# Altium project FRONT.PrjPcb (part 2 of 2)

## Sheet FRONT_MCU_v1.SchDoc: SDR200
size 420 x 297 mm; DocumentNumber: XXXX.468179.001 Э3; SheetNumber: 6; SheetTotal: 7; Title2str: Передняя панель; DocumentType: Схема электрическая принципиальная; Scale: 1:1
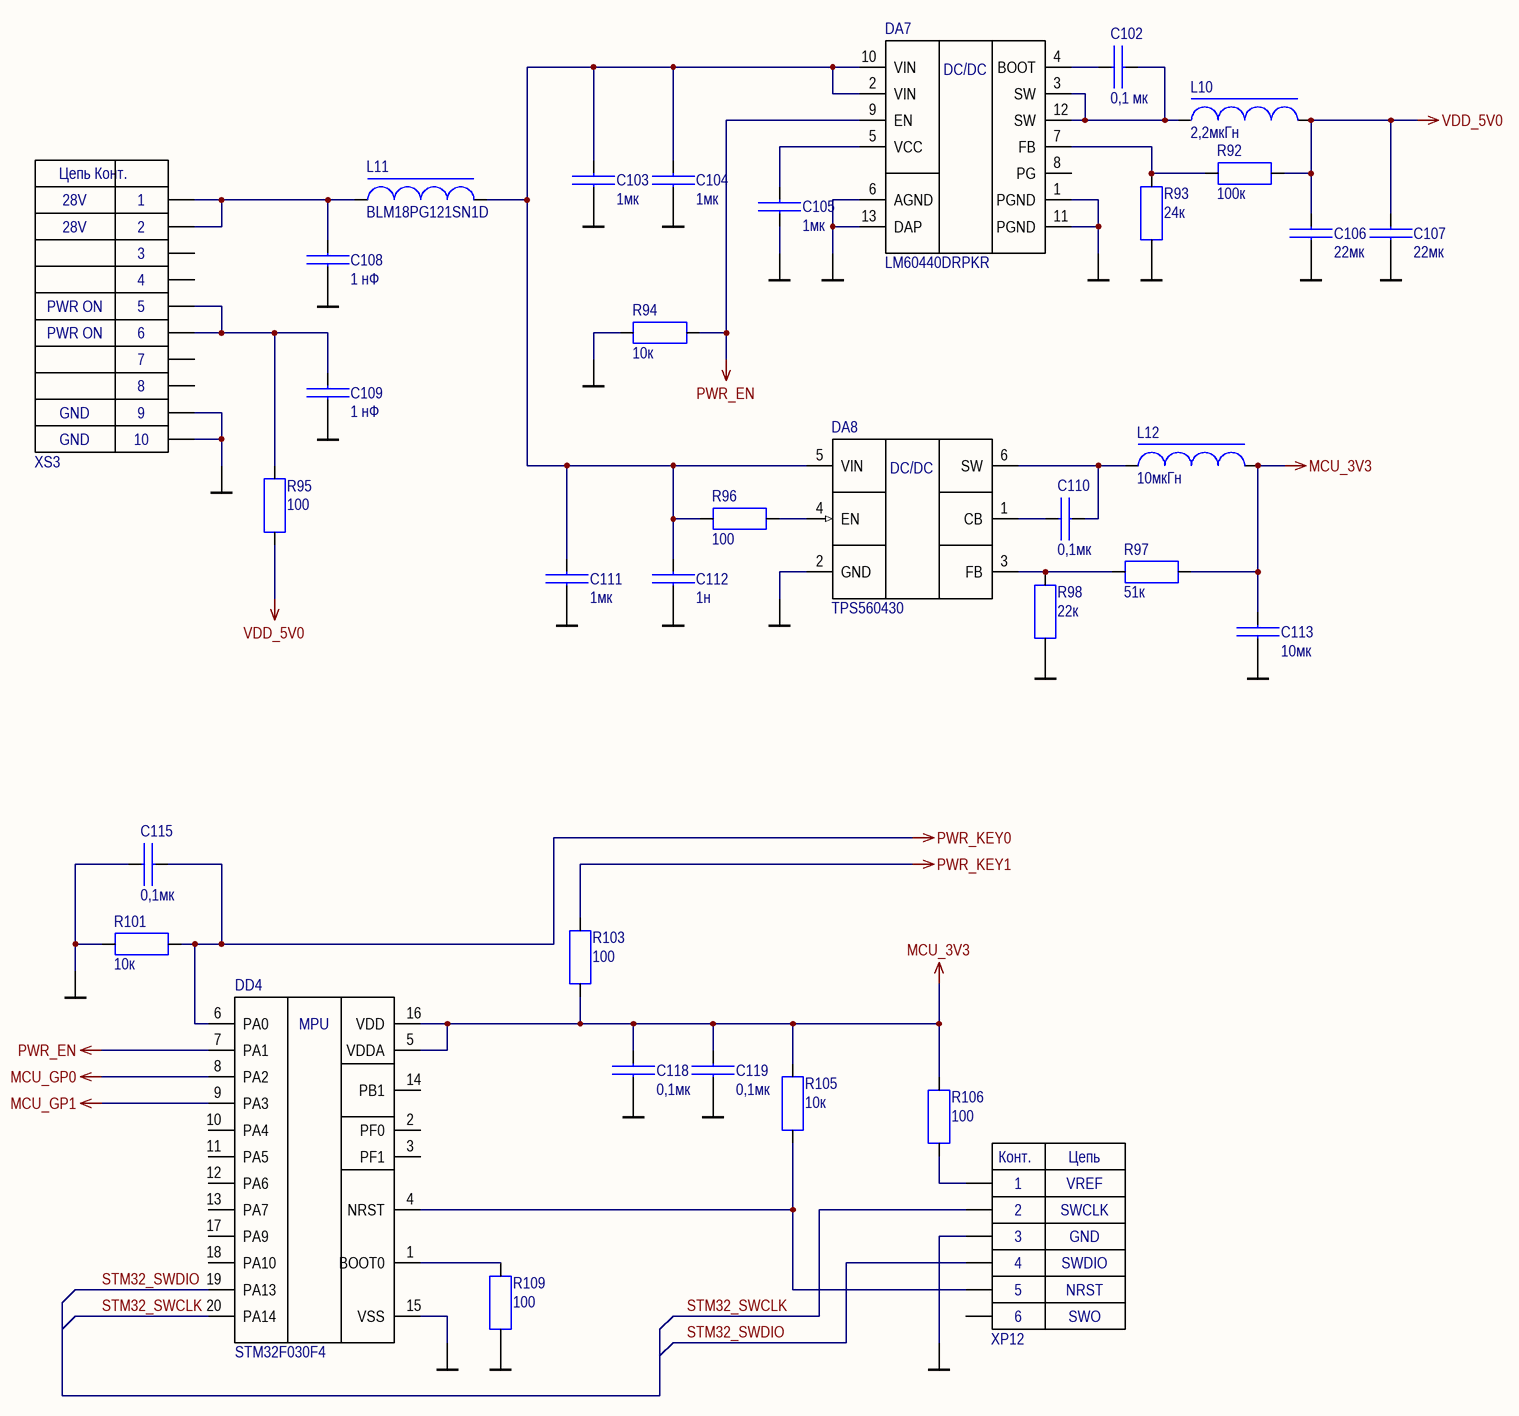
[diagram p5: FRONT_MCU_v1.SchDoc]

### Parts
C102  Nominal: 0,1 мк  [CAPC1005X05L]  (hidden comment: CC0402KRX5R6BB104)
C103  Nominal: 1мк  [CAPC2012X09L]  (hidden comment: CC0805KKX7R9BB105)
C104  Nominal: 1мк  [CAPC2012X09L]  (hidden comment: CC0805KKX7R9BB105)
C105  Nominal: 1мк  [CAPC1005X05L]  (hidden comment: CC0402KRX5R5BB105)
C106  Nominal: 22мк  [CAPC2012X09L]  (hidden comment: CC0805MKX5R5BB226)
C107  Nominal: 22мк  [CAPC2012X09L]  (hidden comment: CC0805MKX5R5BB226)
C108  Nominal: 1 нФ  [CAPC1005X05L]
C109  Nominal: 1 нФ  [CAPC1005X05L]
C110  Nominal: 0,1мк  [CAPC1608X08L]  (hidden comment: CC0603KRX7R9BB103)
C111  Nominal: 1мк  [CAPC2012X09L]  (hidden comment: CC0805KKX7R9BB105)
C112  Nominal: 1н  [CAPC1005X05L]  (hidden comment: C0402C102J5GACTU)
C113  Nominal: 10мк  [CAPC2012X09L]  (hidden comment: CC0805KKX5R8BB106)
C115  Nominal: 0,1мк  [CAPC1005X05L]  (hidden comment: CC0402KRX5R6BB104)
C118  Nominal: 0,1мк  [CAPC1005X05L]  (hidden comment: CC0402KRX5R6BB104)
C119  Nominal: 0,1мк  [CAPC1005X05L]  (hidden comment: CC0402KRX5R6BB104)
DA7  LM60440DRPKR  [WQFN-13]
DA8  TPS560430  [SOT95P280X145-6L]
DD4  STM32F030F4  [TSOP65P640X120-20L]
L10  Nominal: 2,2мкГн  [INDCXGL4020]  (hidden comment: XGL4020-222ME)
L11  BLM18PG121SN1D  [INDC1608X05L]
L12  Nominal: 10мкГн  [INDC1812PS]  (hidden comment: 1812PS-103KR)
R92  Nominal: 100к  [RESC1005X04L]  (hidden comment: RC0402JR-07100KL)
R93  Nominal: 24к  [RESC1005X04L]  (hidden comment: RC0402JR-0724KL)
R94  Nominal: 10к  [RESC1005X04L]  (hidden comment: RC0402JR-0710KL)
R95  Nominal: 100  [RESC1005X04L]  (hidden comment: RC0402JR-07100RL)
R96  Nominal: 100  [RESC1005X04L]  (hidden comment: RC0402JR-07100RL)
R97  Nominal: 51к  [RESC1005X04L]  (hidden comment: RC0402JR-0751KL)
R98  Nominal: 22к  [RESC1005X04L]  (hidden comment: RC0402JR-0722KL)
R101  Nominal: 10к  [RESC1005X04L]  (hidden comment: RC0402JR-0710KL)
R103  Nominal: 100  [RESC1005X04L]  (hidden comment: RC0402JR-07100RL)
R105  Nominal: 10к  [RESC1005X04L]  (hidden comment: RC0402JR-0710KL)
R106  Nominal: 100  [RESC1005X04L]  (hidden comment: RC0402JR-07100RL)
R109  Nominal: 100  [RESC1005X04L]  (hidden comment: RC0402JR-07100RL)
XP12  PLS-6  [HDR1X6]  (value not drawn)
XS3  FH12-10S-0.5SVA  [FH12-10S-0.5SH]  (value not drawn)

### Nets
GND: C103.1 C104.1 C105.1 C106.1 C107.1 C108.1 C109.1 C111.2 C112.2 C113.1 C115.1 C118.2 C119.2 DA7.1(PGND) DA7.6(AGND) DA7.11(PGND) DA7.13(DAP) DA8.2(GND) DD4.15(VSS) R93.2 R94.2 R98.1 R101.2 R109.1 XP12.3 XS3.9 XS3.10
MCU_3V3: C113.2 C118.1 C119.1 DD4.5(VDDA) DD4.16(VDD) L12.1 R97.1 R103.1 R105.2 R106.2
MCU_GP0: DD4.8(PA2)
MCU_GP1: DD4.9(PA3)
PWR_EN: DA7.9(EN) DD4.7(PA1) R94.1
PWR_KEY0: C115.2 DD4.6(PA0) R101.1
PWR_KEY1: R103.2
VDD_5V0: C106.2 C107.2 L10.1 R92.1 R95.1  [project net BL_PWR]
STM32_SWCLK: DD4.20(PA14) XP12.2
STM32_SWDIO: DD4.19(PA13) XP12.4
NetC102_1: C102.1 DA7.4(BOOT)
NetC102_2: C102.2 DA7.3(SW) DA7.12(SW) L10.2
NetC103_2: C103.2 C104.2 C111.1 C112.1 DA7.2(VIN) DA7.10(VIN) DA8.5(VIN) L11.1 R96.1
NetC105_2: C105.2 DA7.5(VCC)
NetC108_2: C108.2 L11.2 XS3.1 XS3.2
NetC109_2: C109.2 R95.2 XS3.5 XS3.6
NetC110_1: C110.1 DA8.1(CB)
NetC110_2: C110.2 DA8.6(SW) L12.2
NetDA7_7: DA7.7(FB) R92.2 R93.1
NetDA8_3: DA8.3(FB) R97.2 R98.2
NetDA8_4: DA8.4(EN) R96.2
NetDD4_1: DD4.1(BOOT0) R109.2
NetDD4_4: DD4.4(NRST) R105.1 XP12.5
NetR106_1: R106.1 XP12.1

Not connected (* = marked no-connect by the designer): DA7 8(PG); DD4 2(PF0) 3(PF1) 10(PA4) 11(PA5) 12(PA6) 13(PA7) 14(PB1) 17(PA9) 18(PA10); XP12 6; XS3 3 4 7 8

### Notes on the sheet
- 28V
- PWR ON
- GND
- Подп. и дата
- Инв. № дубл.
- Взам. инв. №
- Инв. № подл.
- Изм.
- Лист
- № докум.
- Подп.
- Дата
- 2.106-A3
- Копировал
- Формат А3
- (in symbol FH12-10S-0.5SVA) Цепь; Конт.
- (in symbol LM60440DRPKR) DC/DC
- (in symbol STM32 S-LINK PLS-6) Конт.; Цепь; VREF; SWCLK; GND; SWDIO; NRST; SWO
- (in symbol STM32F030F4) MPU
- (in symbol TPS560430) DC/DC

### Library data of the parts
C102 C115 C118 C119 = CC0402KRX5R6BB104: as C1 on sheet FRONT_PWR; ManufacturerPartNumber: CC0402KRX5R6BB104; Rem: *
C103 C104 C111 = CC0805KKX7R9BB105: ЧИП конденсатор; Manufacturer: Yageo; ID: 0805 1 мкФ 50В X7R; Tolerance: 0,1; Type: X7R; Value: 0805 1 мкФ 50В X7R; RuNominal: 1 мкФ; Voltage: 50В; ManufacturerPartNumber: CC0805KKX7R9BB105; Rem: *
C105 = CC0402KRX5R5BB105: ЧИП конденсатор; Manufacturer: Yageo; ID: 0402 1 мкФ 6,3В X5R; Tolerance: 10%; Type: X5R; Value: 0402 1 мкФ 6,3В X5R; RuNominal: 1 мкФ; Voltage: 6,3В; ManufacturerPartNumber: CC0402KRX5R5BB105; Rem: *
C106 C107 = CC0805MKX5R5BB226: ЧИП конденсатор; Manufacturer: Yageo; ID: 0805 22 мкФ 6,3В X5R; Tolerance: 0,2; Type: X5R; Value: 0805 22 мкФ 6,3В X5R; RuNominal: 22 мкФ; Voltage: 6,3В; ManufacturerPartNumber: CC0805MKX5R5BB226; Rem: *
C108 C109 = C0402C102J5GACTU: ЧИП конденсатор; Manufacturer: Yageo; ID: 0402 1 нФ 50В C0G; Tolerance: 5%; Type: C0G; Value: 0402 1 нФ 50В C0G; Voltage: 50В; ManufacturerPartNumber: C0402C102J5GACTU; Rem: *; RuNominal: 1 нФ
C110 = CC0603KRX7R9BB103: ЧИП конденсатор; Manufacturer: Yageo; ID: 0603 0,1 мкФ 50В X7R; Tolerance: 10%; Type: X7R; Value: 0603 0,1 мкФ 50В X7R; RuNominal: 0,1 мкФ; Voltage: 50В; ManufacturerPartNumber: CC0603KRX7R9BB103; Rem: *
C112 = C0402C102J5GACTU: ЧИП конденсатор; Manufacturer: Yageo; ID: 0402 1 нФ 50В C0G; Tolerance: 5%; Type: C0G; Value: 0402 1 нФ 50В C0G; RuNominal: 1 нФ; Voltage: 50В; ManufacturerPartNumber: C0402C102J5GACTU; Rem: *
C113 = CC0805KKX5R8BB106: ЧИП конденсатор; Manufacturer: Yageo; ID: 0805 10 мкФ 25В X7R; Tolerance: 0,1; Type: X7R; Value: 0805 10 мкФ 25В X7R; RuNominal: 10 мкФ; Voltage: 25В; ManufacturerPartNumber: CC0805KKX5R8BB106; Rem: *
DA7 = LM60440DRPKR: 3.8-V to 36-V, 4-A Ultra-Small Synchronous Step-Down Converter; Manufacturer: TI; Value: LM60440DRPKR; ComponentLink1Description: datasheet; ComponentLink1URL: https://www.ti.com/lit/ds/symlink/lm60440.pdf?HQS=dis-dk-null-digikeymode-dsf-pf-null-wwe&ts=1663282176250&ref_url=https%253A%252F%252Fwww.digikey.si%252F; ManufacturerPartNumber: LM60440DRPKR; Rem: *
DA8 = TPS560430: SIMPLE SWITCHER® 4-V to 36-V, 600-mA Synchronous Step-Down Converter; Manufacturer: TI; Value: TPS560430; ComponentLink1Description: datasheet; ComponentLink1URL: https://www.ti.com/lit/ds/symlink/tps560430.pdf?ts=1769393151340; ManufacturerPartNumber: TPS560430; Rem: *
DD4 = STM32F030F4: Value-line Arm®-based 32-bit MCU with16 KB Flash, timers, ADC, communication interfaces, 2.4-3.6 V operation; Manufacturer: STM; ComponentLink1Description: datasheet; ComponentLink1URL: http://www.analog.com/media/en/technical-documentation/data-sheets/ADCLK944.pdf; ManufacturerPartNumber: STM32F030F4; Rem: *; Value: STM32F030F4
L10 = XGL4020-222ME: Shielded Power Inductors; Manufacturer: Coilcraft; ID: XGL4020 2,2мкГн; Value: XGL4020 2,2мкГн; Current: 2,7А; DC Res: 19,5mOhms; ManufacturerPartNumber: XGL4020-222ME
L11 = BLM18PG121SN1D: as L5 on sheet FRONT_PWR; Nominal: BLM18PG121SN1D; ID: BLM18PG121SN1D; ManufacturerPartNumber: BLM18PG121SN1D; Value: BLM18PG121SN1D
L12 = 1812PS-103KR: Shielded High SRF Inductors; Manufacturer: Coilcraft; ID: 1812PS 10мкГн 10%; Rem: 10%; Value: 1812PS 10мкГн 10%; Current: 0,9А; DC Res: 0.17; ManufacturerPartNumber: 1812PS-103KR
R92 = RC0402JR-07100KL: ЧИП резистор; Manufacturer: Yageo; ID: 0402 100 кОм 5%; Tolerance: 5%; Value: 0402 100 кОм 5%; ManufacturerPartNumber: RC0402JR-07100KL; Rem: *; Type: *
R93 = RC0402JR-0724KL: ЧИП резистор; Manufacturer: Yageo; ID: 0402 24 кОм 5%; Tolerance: 5%; Value: 0402 24 кОм 5%; ManufacturerPartNumber: RC0402JR-0724KL; Rem: *; Type: *
R94 R101 R105 = RC0402JR-0710KL: as R1 on sheet FRONT_PWR; ManufacturerPartNumber: RC0402JR-0710KL; Rem: *; Type: *
R95 R96 R103 R106 R109 = RC0402JR-07100RL: as R21 on sheet FRONT_LCD; ManufacturerPartNumber: RC0402JR-07100RL; Rem: *; Type: *
R97 = RC0402JR-0751KL: ЧИП резистор; Manufacturer: Yageo; ID: 0402 51 кОм 5%; Tolerance: 5%; Value: 0402 51 кОм 5%; ManufacturerPartNumber: RC0402JR-0751KL; Rem: *; Type: *
R98 = RC0402JR-0722KL: ЧИП резистор; Manufacturer: Yageo; ID: 0402 22 кОм 5%; Tolerance: 5%; Value: 0402 22 кОм 5%; ManufacturerPartNumber: RC0402JR-0722KL; Rem: *; Type: *
XP12 = STM32 S-LINK PLS-6
XS3 = FH12-10S-0.5SVA: Manufacturer: Hirose; ManufacturerPartNumber: FH12-10S-0.5SVA

## Sheet FRONT_INTF.SchDoc: SDR200
size 420 x 297 mm; DocumentNumber: XXXX.468179.001 Э3; SheetNumber: 7; SheetTotal: 7; Title2str: Передняя панель; DocumentType: Схема электрическая принципиальная; Scale: 1:1
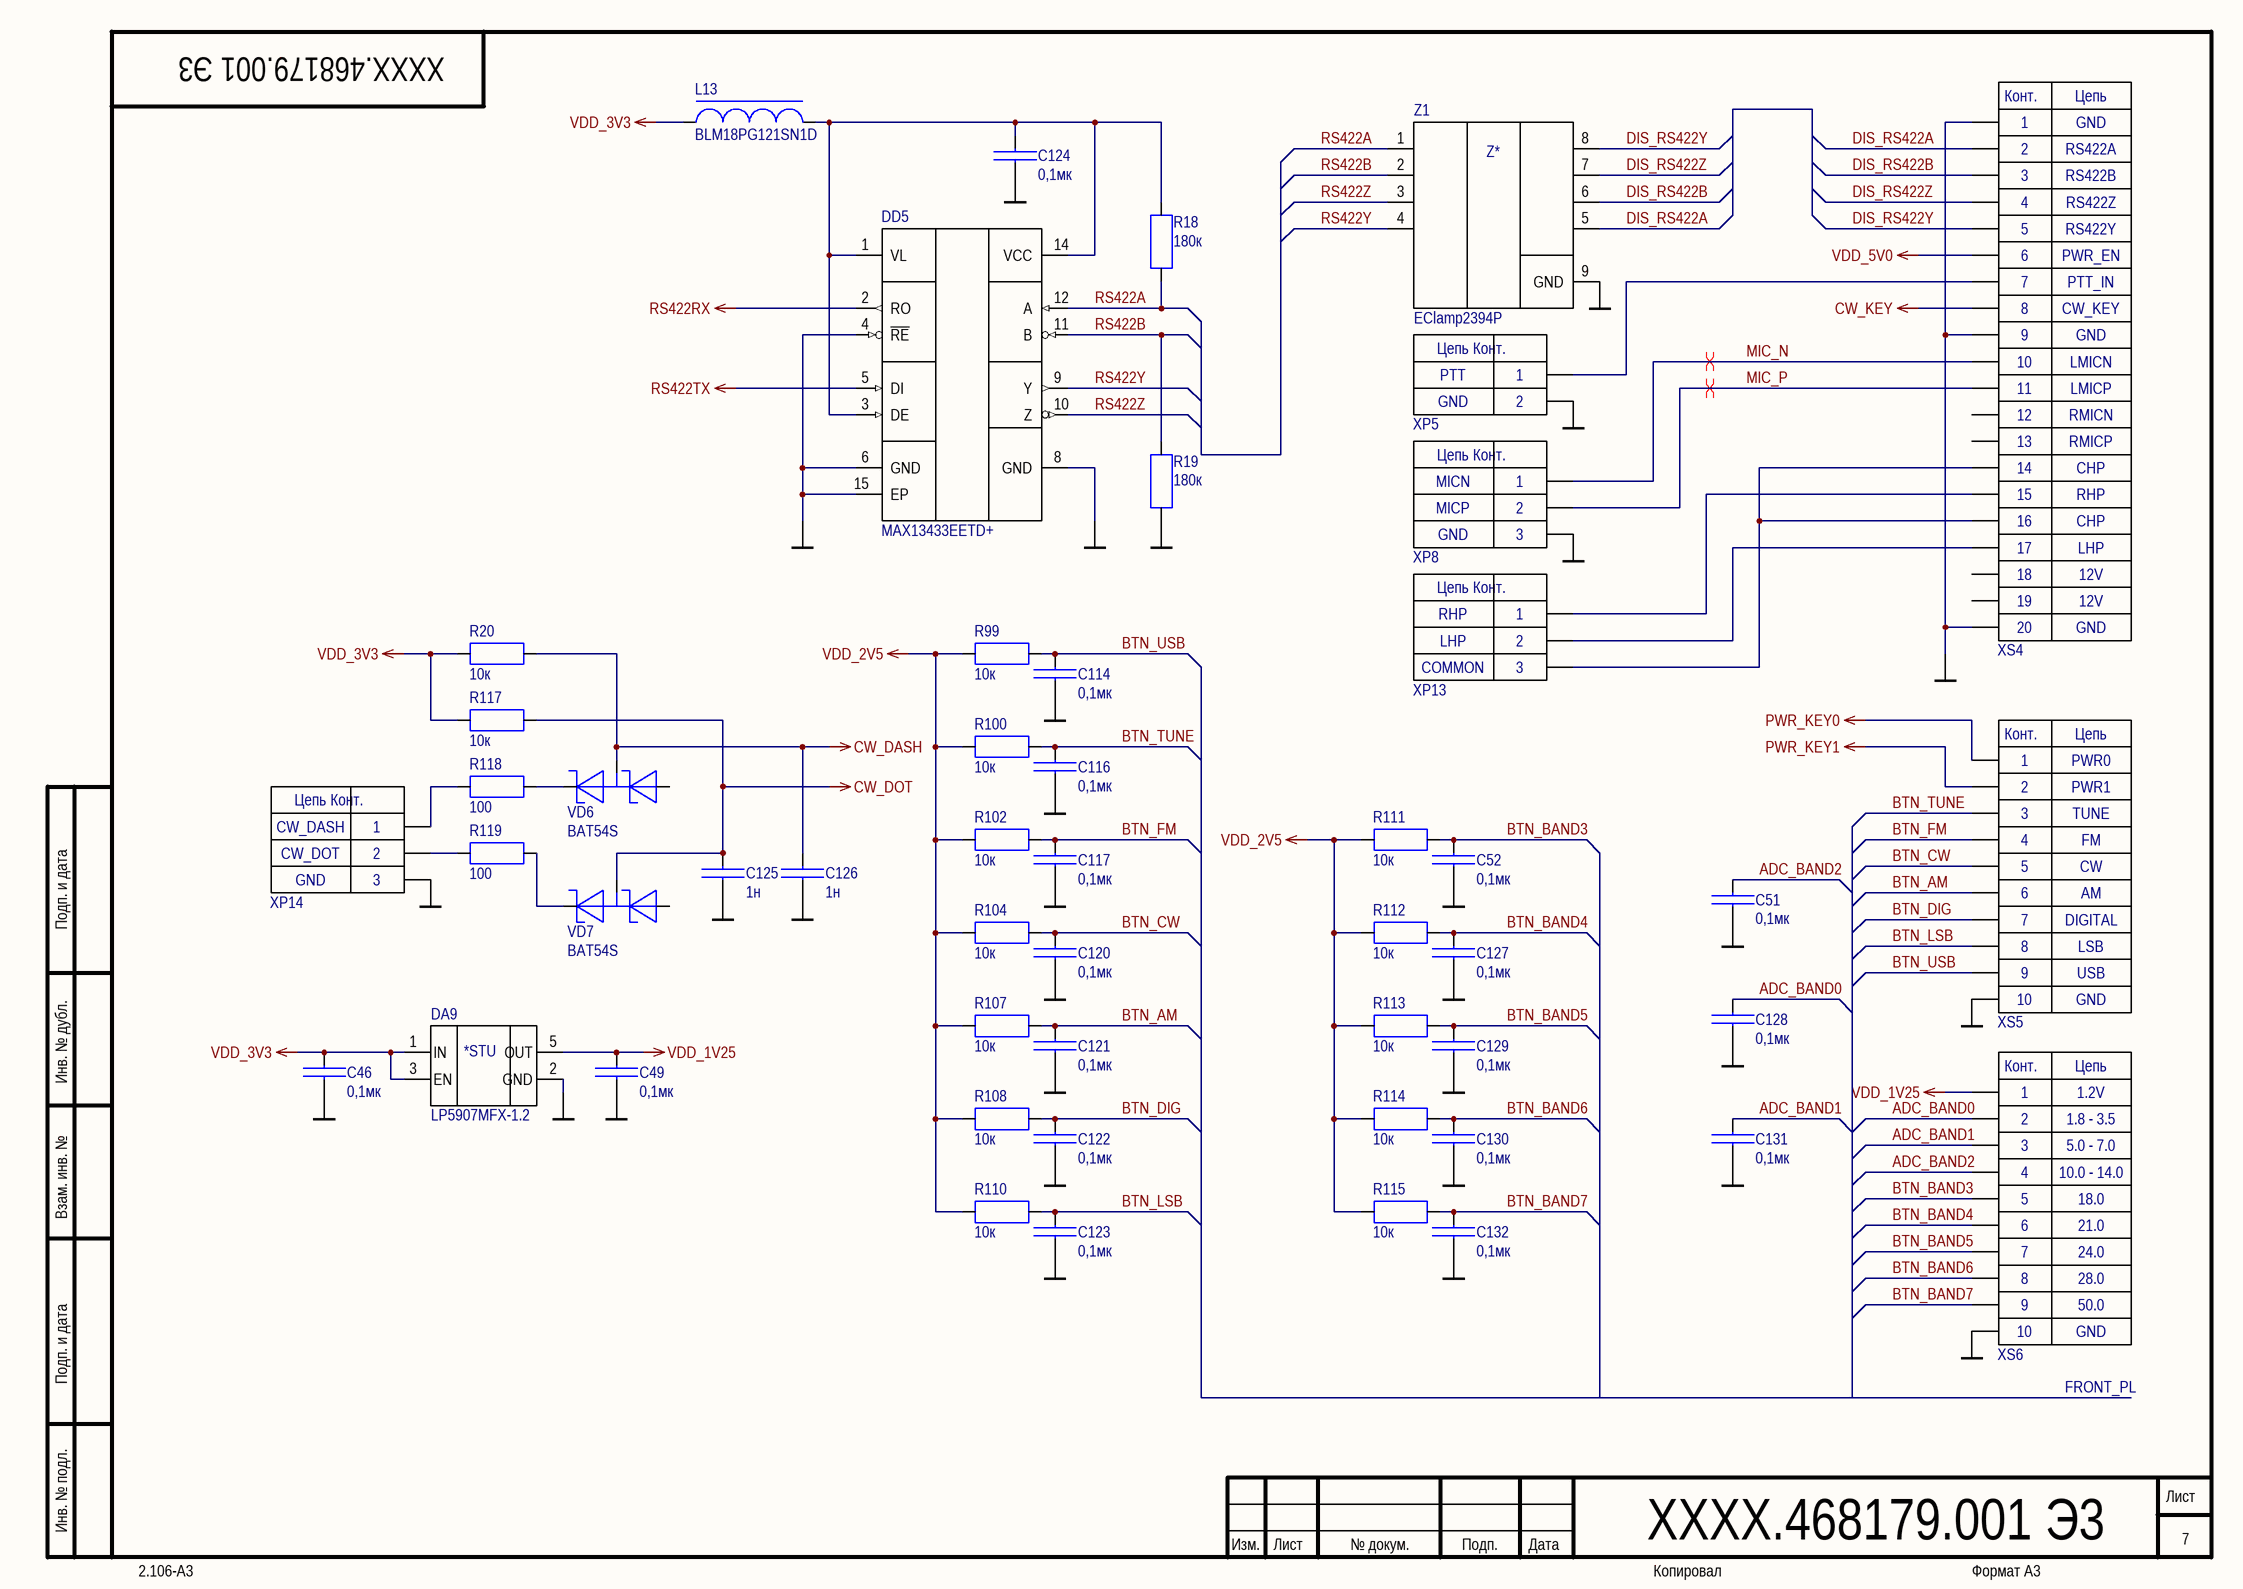
[diagram p6: FRONT_INTF.SchDoc]

### Parts
C46  Nominal: 0,1мк  [CAPC1005X05L]  (hidden comment: CC0402KRX5R6BB104)
C49  Nominal: 0,1мк  [CAPC1005X05L]  (hidden comment: CC0402KRX5R6BB104)
C51  Nominal: 0,1мк  [CAPC1005X05L]  (hidden comment: CC0402KRX5R6BB104)
C52  Nominal: 0,1мк  [CAPC1005X05L]  (hidden comment: CC0402KRX5R6BB104)
C114  Nominal: 0,1мк  [CAPC1005X05L]  (hidden comment: CC0402KRX5R6BB104)
C116  Nominal: 0,1мк  [CAPC1005X05L]  (hidden comment: CC0402KRX5R6BB104)
C117  Nominal: 0,1мк  [CAPC1005X05L]  (hidden comment: CC0402KRX5R6BB104)
C120  Nominal: 0,1мк  [CAPC1005X05L]  (hidden comment: CC0402KRX5R6BB104)
C121  Nominal: 0,1мк  [CAPC1005X05L]  (hidden comment: CC0402KRX5R6BB104)
C122  Nominal: 0,1мк  [CAPC1005X05L]  (hidden comment: CC0402KRX5R6BB104)
C123  Nominal: 0,1мк  [CAPC1005X05L]  (hidden comment: CC0402KRX5R6BB104)
C124  Nominal: 0,1мк  [CAPC1005X05L]  (hidden comment: CC0402KRX5R6BB104)
C125  Nominal: 1н  [CAPC1005X05L]  (hidden comment: C0402C102J5GACTU)
C126  Nominal: 1н  [CAPC1005X05L]  (hidden comment: C0402C102J5GACTU)
C127  Nominal: 0,1мк  [CAPC1005X05L]  (hidden comment: CC0402KRX5R6BB104)
C128  Nominal: 0,1мк  [CAPC1005X05L]  (hidden comment: CC0402KRX5R6BB104)
C129  Nominal: 0,1мк  [CAPC1005X05L]  (hidden comment: CC0402KRX5R6BB104)
C130  Nominal: 0,1мк  [CAPC1005X05L]  (hidden comment: CC0402KRX5R6BB104)
C131  Nominal: 0,1мк  [CAPC1005X05L]  (hidden comment: CC0402KRX5R6BB104)
C132  Nominal: 0,1мк  [CAPC1005X05L]  (hidden comment: CC0402KRX5R6BB104)
DA9  LP5907MFX-1.2  [SOT95P280X145-5L]
DD5  MAX13433EETD+  [SON40P300X80_HS-15L]
L13  BLM18PG121SN1D  [INDC1608X05L]
R18  Nominal: 180к  [RESC1005X04L]  (hidden comment: RC0402JR-07180KL)
R19  Nominal: 180к  [RESC1005X04L]  (hidden comment: RC0402JR-07180KL)
R20  Nominal: 10к  [RESC1005X04L]  (hidden comment: RC0402JR-0710KL)
R99  Nominal: 10к  [RESC1005X04L]  (hidden comment: RC0402JR-0710KL)
R100  Nominal: 10к  [RESC1005X04L]  (hidden comment: RC0402JR-0710KL)
R102  Nominal: 10к  [RESC1005X04L]  (hidden comment: RC0402JR-0710KL)
R104  Nominal: 10к  [RESC1005X04L]  (hidden comment: RC0402JR-0710KL)
R107  Nominal: 10к  [RESC1005X04L]  (hidden comment: RC0402JR-0710KL)
R108  Nominal: 10к  [RESC1005X04L]  (hidden comment: RC0402JR-0710KL)
R110  Nominal: 10к  [RESC1005X04L]  (hidden comment: RC0402JR-0710KL)
R111  Nominal: 10к  [RESC1005X04L]  (hidden comment: RC0402JR-0710KL)
R112  Nominal: 10к  [RESC1005X04L]  (hidden comment: RC0402JR-0710KL)
R113  Nominal: 10к  [RESC1005X04L]  (hidden comment: RC0402JR-0710KL)
R114  Nominal: 10к  [RESC1005X04L]  (hidden comment: RC0402JR-0710KL)
R115  Nominal: 10к  [RESC1005X04L]  (hidden comment: RC0402JR-0710KL)
R117  Nominal: 10к  [RESC1005X04L]  (hidden comment: RC0402JR-0710KL)
R118  Nominal: 100  [RESC1005X04L]  (hidden comment: RC0402JR-07100RL)
R119  Nominal: 100  [RESC1005X04L]  (hidden comment: RC0402JR-07100RL)
VD6  BAT54S  [SOT95P240X120-3L]
VD7  BAT54S  [SOT95P240X120-3L]
XP5  WB-02  [WB-02 (MW-2M) PITCH 2.00MM]  (value not drawn)
XP8  WB-03  [WB-03 (MW-3M) PITCH 2.00MM]  (value not drawn)
XP13  WB-03  [WB-03 (MW-3M) PITCH 2.00MM]  (value not drawn)
XP14  WB-03  [WB-03 (MW-3M) PITCH 2.00MM]  (value not drawn)
XS4  FH12-20S-0.5SVA  [FH12-20S-0.5SVA]  (value not drawn)
XS5  FH12-10S-0.5SVA  [FH12-10S-0.5SH]  (value not drawn)
XS6  FH12-10S-0.5SVA  [FH12-10S-0.5SH]  (value not drawn)
Z1  EClamp2394P  [SON50P160X65_HS-9N]

### Nets
CW_DASH: C126.1 R20.1 VD6.1
CW_DOT: C125.1 R117.1 VD7.1
CW_KEY: XS4.8
GND: C46.1 C49.1 C51.2 C52.2 C114.2 C116.2 C117.2 C120.2 C121.2 C122.2 C123.2 C124.1 C125.2 C126.2 C127.2 C128.2 C129.2 C130.2 C131.2 C132.2 DA9.2(GND) DD5.4(~{RE}) DD5.6(GND) DD5.8(GND) DD5.15(EP) R19.1 XP5.2 XP8.3 XP14.3 XS4.1 XS4.9 XS4.20 XS5.10 XS6.10 Z1.9(GND)
PWR_KEY0: XS5.1
PWR_KEY1: XS5.2
RS422RX: DD5.2(RO)
RS422TX: DD5.5(DI)
VDD_1V25: C49.2 DA9.5(OUT) XS6.1
VDD_2V5: R99.2 R100.2 R102.2 R104.2 R107.2 R108.2 R110.2 R111.2 R112.2 R113.2 R114.2 R115.2
VDD_3V3: C46.2 DA9.1(IN) DA9.3(EN) L13.2 R20.2 R117.2
VDD_5V0: XS4.6  [project net BL_PWR]
ADC_BAND0: C128.1 XS6.2
ADC_BAND1: C131.1 XS6.3
ADC_BAND2: C51.1 XS6.4
BTN_AM: C121.1 R107.1 XS5.6
BTN_BAND3: C52.1 R111.1 XS6.5
BTN_BAND4: C127.1 R112.1 XS6.6
BTN_BAND5: C129.1 R113.1 XS6.7
BTN_BAND6: C130.1 R114.1 XS6.8
BTN_BAND7: C132.1 R115.1 XS6.9
BTN_CW: C120.1 R104.1 XS5.5
BTN_DIG: C122.1 R108.1 XS5.7
BTN_FM: C117.1 R102.1 XS5.4
BTN_LSB: C123.1 R110.1 XS5.8
BTN_TUNE: C116.1 R100.1 XS5.3
BTN_USB: C114.1 R99.1 XS5.9
DIS_RS422A: XS4.2 Z1.5
DIS_RS422B: XS4.3 Z1.6
DIS_RS422Y: XS4.5 Z1.8
DIS_RS422Z: XS4.4 Z1.7
MIC_N: XP8.1 XS4.10
MIC_P: XP8.2 XS4.11
RS422A: DD5.12(A) R18.1 Z1.1
RS422B: DD5.11(B) R19.2 Z1.2
RS422Y: DD5.9(Y) Z1.4
RS422Z: DD5.10(Z) Z1.3
NetC124_2: C124.2 DD5.1(VL) DD5.3(DE) DD5.14(VCC) L13.1 R18.2
NetR118_1: R118.1 VD6.3(K)
NetR118_2: R118.2 XP14.1
NetR119_1: R119.1 VD7.3(K)
NetR119_2: R119.2 XP14.2
NetXP5_1: XP5.1 XS4.7
NetXP13_1: XP13.1 XS4.15
NetXP13_2: XP13.2 XS4.17
NetXP13_3: XP13.3 XS4.14 XS4.16

Not connected (* = marked no-connect by the designer): VD6 2(A); VD7 2(A); XS4 12 13 18 19

### Layout directives
differential pair: MIC_N, MIC_P

### Notes on the sheet
- GND
- RS422A
- RS422B
- RS422Z
- RS422Y
- PWR_EN
- PTT_IN
- CW_KEY
- PTT
- LMICN
- LMICP
- RMICN
- RMICP
- CHP
- MICN
- MICP
- RHP
- 12V
- LHP
- COMMON
- PWR0
- PWR1
- CW_DASH
- CW_DOT
- CW
- FM
- TUNE
- DIGITAL
- AM
- USB
- LSB
- 1.8 - 3.5
- 1.2V
- 5.0 - 7.0
- (near XS6) 10.0 - 14.0
- 18.0
- 28.0
- 24.0
- 21.0
- 50.0
- FRONT_PL
- Подп. и дата
- Инв. № дубл.
- Взам. инв. №
- Инв. № подл.
- Изм.
- Лист
- № докум.
- Подп.
- Дата
- 2.106-A3
- Копировал
- Формат А3
- (in symbol EClamp2394P) Z*
- (in symbol FH12-10S-0.5SVA) Конт.; Цепь
- (in symbol FH12-20S-0.5SVA) Конт.; Цепь
- (in symbol LP5907MFX-1.2) *STU
- (in symbol WB-02) Цепь; Конт.
- (in symbol WB-03) Цепь; Конт.

### Library data of the parts
C46 C49 C51 C52 C114 C116 C117 C120-C124 C127-C132 = CC0402KRX5R6BB104: ЧИП конденсатор; Manufacturer: Yageo; ID: 0402 0,1 мкФ 10В X7R; Tolerance: 10%; Type: X7R; Value: 0402 0,1 мкФ 10В X7R; RuNominal: 0,1 мкФ; Voltage: 10В; ManufacturerPartNumber: CC0402KRX5R6BB104; Rem: *
C125 C126 = C0402C102J5GACTU: ЧИП конденсатор; Manufacturer: Yageo; ID: 0402 1 нФ 50В C0G; Tolerance: 5%; Type: C0G; Value: 0402 1 нФ 50В C0G; RuNominal: 1 нФ; Voltage: 50В; ManufacturerPartNumber: C0402C102J5GACTU; Rem: *
DA9 = LP5907MFX-1.2: LP5907 250mA, Low-Noise, Low-IQ LDO; Manufacturer: TI; Rem: SOT-23; ComponentLink1Description: datasheet; ComponentLink1URL: *; Value: LP5907MFX-1.2; ID: LP5907MFX-1.2; ManufacturerPartNumber: LP5907MFX-1.2; datasheet: http://www.ti.com/lit/ds/symlink/lp5907.pdf
DD5 = MAX13433EETD+: RS-422 Transceivers with Low-Voltage Logic Interface 16M; Manufacturer: AD; ComponentLink1Description: datasheet; ComponentLink1URL: https://static.chipdip.ru/lib/039/DOC028039660.pdf; ManufacturerPartNumber: MAX13433EETD+; Rem: *; Value: MAX13433EETD+
L13 = BLM18PG121SN1D: Chip Ferrite Beads (0603 Size); Manufacturer: Murata; Rem: 120ohm ±25%; Current: 2000mA; DC Res: 0.05ohm; Nominal: BLM18PG121SN1D; ID: BLM18PG121SN1D; ManufacturerPartNumber: BLM18PG121SN1D; Value: BLM18PG121SN1D
R18 R19 = RC0402JR-07180KL: ЧИП резистор; Manufacturer: Yageo; ID: 0402 180 кОм 5%; Tolerance: 5%; Value: 0402 180 кОм 5%; ManufacturerPartNumber: RC0402JR-07180KL; Rem: *; Type: *
R20 R99 R100 R102 R104 R107 R108 R110-R115 R117 = RC0402JR-0710KL: ЧИП резистор; Manufacturer: Yageo; ID: 0402 10 кОм 5%; Tolerance: 5%; Value: 0402 10 кОм 5%; ManufacturerPartNumber: RC0402JR-0710KL; Rem: *; Type: *
R118 R119 = RC0402JR-07100RL: ЧИП резистор; Manufacturer: Yageo; ID: 0402 100 Ом 5%; Tolerance: 5%; Value: 0402 100 Ом 5%; ManufacturerPartNumber: RC0402JR-07100RL; Rem: *; Type: *
VD6 VD7 = BAT54S: SCHOTTKY DIODE; Manufacturer: International Rectifier; Rem: 0.2Amp 30V; Value: BAT54S; ID: BAT54S; ManufacturerPartNumber: BAT54S; datasheet: https://static.chipdip.ru/lib/196/DOC000196695.pdf
XP5 = WB-02: WB-02 (MW-2M) pitch 2.00mm / DS1066-02M; ManufacturerPartNumber: WB-02
XP8 XP13 XP14 = WB-03: WB-03(MW-3M) pitch 2.00mm / DS1066-03M
XS4 = FH12-20S-0.5SVA: FPC Connectors, Flex-to-Board, 20 Position, .5mm [.02in]; Manufacturer: Hirose; ManufacturerPartNumber: FH12-20S-0.5SVA
XS5 XS6 = FH12-10S-0.5SVA: Manufacturer: Hirose; ManufacturerPartNumber: FH12-10S-0.5SVA
Z1 = EClamp2394P: ESD-EMI 4-line Protection for Color LCD Interfaces; Manufacturer: SEMTECH; Value: EClamp2394P; ComponentLink1Description: datasheet; ComponentLink1URL: https://semtech.my.salesforce.com/sfc/p/#E0000000JelG/a/44000000MCQv/tLOuuaZwODheyCzafOGtui7bNA1cSjYbUE_tOk41Kw4; ManufacturerPartNumber: ECLAMP2394P; Rem: *

## Nets that join several sheets
BL_PWR: FRONT_PWR (11 pins), FRONT_PL_v1 (XP1.1), FRONT_LCD (8 pins), FRONT_DDR (C88.2 DA6.3 DA6.7), FRONT_MCU_v1 (5 pins), FRONT_INTF (XS4.6)
CW_DASH: FRONT_PS (DD1.C17  ), FRONT_INTF (C126.1 R20.1 VD6.1)
CW_DOT: FRONT_PS (DD1.A16  ), FRONT_INTF (C125.1 R117.1 VD7.1)
CW_KEY: FRONT_PS (DD1.A19  ), FRONT_INTF (XS4.8)
GND: FRONT_PWR (113 pins), FRONT_PL_v1 (29 pins), FRONT_LCD (32 pins), FRONT_DDR (51 pins), FRONT_PS (34 pins), FRONT_MCU_v1 (27 pins), FRONT_INTF (35 pins)
LCD_DCTRL: FRONT_PL_v1 (DD1.P18  ), FRONT_LCD (DA5.17 R49.1)
LCD_EN: FRONT_PL_v1 (DD1.P15  ), FRONT_LCD (DA5.11 R48.1)
MCU_GP0: FRONT_PS (DD1.A14  ), FRONT_MCU_v1 (DD4.8)
MCU_GP1: FRONT_PS (DD1.A15  ), FRONT_MCU_v1 (DD4.9)
POR_B: FRONT_PWR (DA1.4 DA2.4 DA3.4), FRONT_PS (C97.2 DD1.C7    R83.1)
PWR_KEY0: FRONT_MCU_v1 (C115.2 DD4.6 R101.1), FRONT_INTF (XS5.1)
PWR_KEY1: FRONT_MCU_v1 (R103.2), FRONT_INTF (XS5.2)
RS422RX: FRONT_PS (DD1.B17  ), FRONT_INTF (DD5.2)
RS422TX: FRONT_PS (DD1.D11  ), FRONT_INTF (DD5.5)
VDD_1V8: FRONT_PWR (24 pins), FRONT_PS (DD1.J9   )
VDD_1V25: FRONT_PL_v1 (XP3.1 XP4.1 XP6.1 XP9.1), FRONT_INTF (C49.2 DA9.5 XS6.1)
VDD_2V5: FRONT_PWR (C9.2 C10.2 L2.1 R4.1), FRONT_PL_v1 (11 pins), FRONT_INTF (12 pins)
VDD_3V3: FRONT_PWR (C4.2 C5.2 L1.1 R2.1), FRONT_PL_v1 (12 pins), FRONT_LCD (L8.2 R43.1), FRONT_PS (35 pins), FRONT_INTF (6 pins)
ADC_BAND0: FRONT_PL_v1 (DD1.L19  ), FRONT_INTF (C128.1 XS6.2)
ADC_BAND1: FRONT_PL_v1 (DD1.M19  ), FRONT_INTF (C131.1 XS6.3)
ADC_BAND2: FRONT_PL_v1 (DD1.E17  ), FRONT_INTF (C51.1 XS6.4)
BTN_AM: FRONT_PL_v1 (DD1.N16  ), FRONT_INTF (C121.1 R107.1 XS5.6)
BTN_BAND3: FRONT_PL_v1 (DD1.K16  ), FRONT_INTF (C52.1 R111.1 XS6.5)
BTN_BAND4: FRONT_PL_v1 (DD1.M18  ), FRONT_INTF (C127.1 R112.1 XS6.6)
BTN_BAND5: FRONT_PL_v1 (DD1.M17  ), FRONT_INTF (C129.1 R113.1 XS6.7)
BTN_BAND6: FRONT_PL_v1 (DD1.K18  ), FRONT_INTF (C130.1 R114.1 XS6.8)
BTN_BAND7: FRONT_PL_v1 (DD1.K17  ), FRONT_INTF (C132.1 R115.1 XS6.9)
BTN_CW: FRONT_PL_v1 (DD1.M15  ), FRONT_INTF (C120.1 R104.1 XS5.5)
BTN_DIG: FRONT_PL_v1 (DD1.L14  ), FRONT_INTF (C122.1 R108.1 XS5.7)
BTN_FM: FRONT_PL_v1 (DD1.N15  ), FRONT_INTF (C117.1 R102.1 XS5.4)
BTN_LSB: FRONT_PL_v1 (DD1.K14  ), FRONT_INTF (C123.1 R110.1 XS5.8)
BTN_TUNE: FRONT_PL_v1 (DD1.M14  ), FRONT_INTF (C116.1 R100.1 XS5.3)
BTN_USB: FRONT_PL_v1 (DD1.L16  ), FRONT_INTF (C114.1 R99.1 XS5.9)
LCD_B0: FRONT_PL_v1 (DD1.Y18  ), FRONT_LCD (R42.2)
LCD_B1: FRONT_PL_v1 (DD1.T16  ), FRONT_LCD (R41.2)
LCD_B2: FRONT_PL_v1 (DD1.V17  ), FRONT_LCD (R40.2)
LCD_B3: FRONT_PL_v1 (DD1.W18  ), FRONT_LCD (R38.2)
LCD_B4: FRONT_PL_v1 (DD1.T17  ), FRONT_LCD (R37.2)
LCD_B5: FRONT_PL_v1 (DD1.Y19  ), FRONT_LCD (R35.2)
LCD_B6: FRONT_PL_v1 (DD1.W19  ), FRONT_LCD (R34.2)
LCD_B7: FRONT_PL_v1 (DD1.W20  ), FRONT_LCD (R31.2)
LCD_DCLK: FRONT_PL_v1 (DD1.V12  ), FRONT_LCD (R66.2)
LCD_DE: FRONT_PL_v1 (DD1.V20  ), FRONT_LCD (R24.2)
LCD_DITHB: FRONT_PL_v1 (DD1.T10  ), FRONT_LCD (X1.47)
LCD_G0: FRONT_PL_v1 (DD1.W15  ), FRONT_LCD (R56.2)
LCD_G1: FRONT_PL_v1 (DD1.V15  ), FRONT_LCD (R55.2)
LCD_G2: FRONT_PL_v1 (DD1.V16  ), FRONT_LCD (R54.2)
LCD_G3: FRONT_PL_v1 (DD1.W16  ), FRONT_LCD (R53.2)
LCD_G4: FRONT_PL_v1 (DD1.Y16  ), FRONT_LCD (R50.2)
LCD_G5: FRONT_PL_v1 (DD1.U15  ), FRONT_LCD (R47.2)
LCD_G6: FRONT_PL_v1 (DD1.Y17  ), FRONT_LCD (R45.2)
LCD_G7: FRONT_PL_v1 (DD1.T15  ), FRONT_LCD (R44.2)
LCD_HSYNC: FRONT_PL_v1 (DD1.U18  ), FRONT_LCD (R29.2)
LCD_L/R: FRONT_PL_v1 (DD1.U12  ), FRONT_LCD (X1.39)
LCD_MODE: FRONT_PL_v1 (DD1.U20  ), FRONT_LCD (R23.2)
LCD_R0: FRONT_PL_v1 (DD1.U13  ), FRONT_LCD (R65.2)
LCD_R1: FRONT_PL_v1 (DD1.V13  ), FRONT_LCD (R64.2)
LCD_R2: FRONT_PL_v1 (DD1.T14  ), FRONT_LCD (R63.2)
LCD_R3: FRONT_PL_v1 (DD1.W13  ), FRONT_LCD (R62.2)
LCD_R4: FRONT_PL_v1 (DD1.U14  ), FRONT_LCD (R60.2)
LCD_R5: FRONT_PL_v1 (DD1.W14  ), FRONT_LCD (R59.2)
LCD_R6: FRONT_PL_v1 (DD1.R14  ), FRONT_LCD (R58.2)
LCD_R7: FRONT_PL_v1 (DD1.Y14  ), FRONT_LCD (R57.2)
LCD_RESET: FRONT_PL_v1 (DD1.T11  ), FRONT_LCD (X1.44)
LCD_U/D: FRONT_PL_v1 (DD1.T12  ), FRONT_LCD (X1.40)
LCD_VSYNC: FRONT_PL_v1 (DD1.U19  ), FRONT_LCD (R26.2)